# Altium project transmitter-pcb-project.PrjPcb
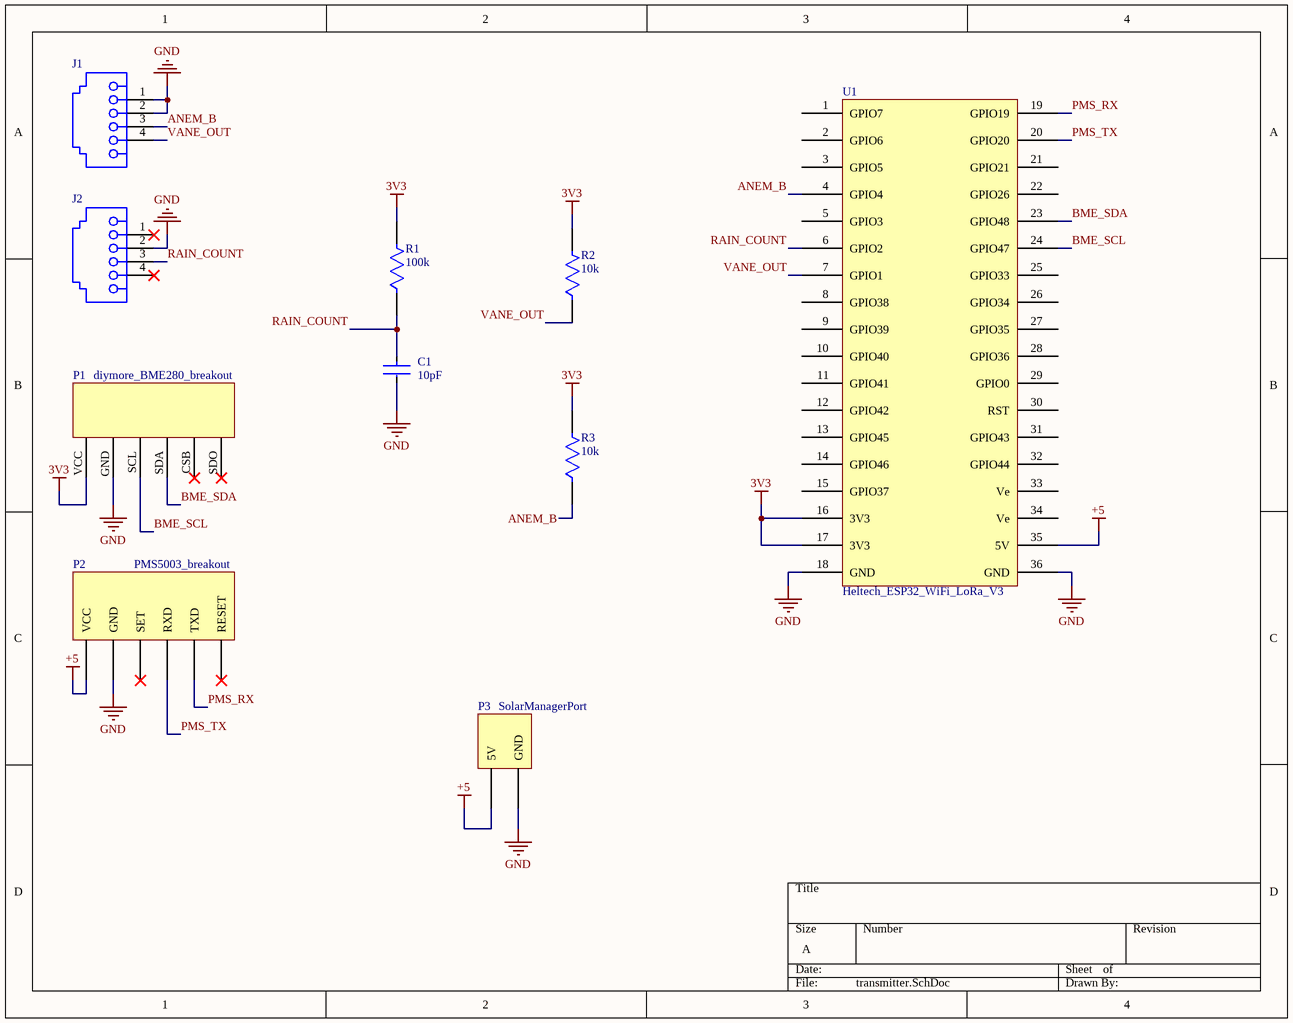
[diagram p0: transmitter.SchDoc]
1 sheet, 10 parts. Net scope: global (net labels, ports and power ports of the same name join across sheets).
Board file: transmitter.PcbDoc

## Sheet transmitter.SchDoc
size A; SheetNumber: 1; SheetTotal: 1

### Parts
C1  Capacitance: 10pF  [FP-VY2103M63Y5US63V7-MFG]  (hidden comment: VY2103M63Y5US63V7)
J1  615004144121  [615004144121]  (value not drawn)
J2  615004144121  [615004144121]  (value not drawn)
P1  diymore_BME280_breakout  [PCBComponent_1]
P2  PMS5003_breakout  [PCBComponent_1]
P3  SolarManagerPort  [PCBComponent_1]
R1  Resistance: 100k  [FP-MRS25-MFG]  (hidden comment: MRS25000C1002FCT00)
R2  Resistance: 10k  [FP-MRS25-MFG]  (hidden comment: MRS25000C1002FCT00)
R3  Resistance: 10k  [FP-MRS25-MFG]  (hidden comment: MRS25000C1002FCT00)
U1  Heltech_ESP32_WiFi_LoRa_V3  [PCBComponent_1]

### Nets
3V3: P1.VCC R1.2 R2.2 R3.2 U1.16(3V3) U1.17(3V3)
+5: P2.VCC P3.5V U1.35(5V)
GND: C1.2 J1.1 J1.2 J2.2 P1.GND P2.GND P3.GND U1.18(GND) U1.36(GND)
ANEM_B: J1.3 R3.1 U1.4(GPIO4)
BME_SCL: P1.SCL U1.24(GPIO47)
BME_SDA: P1.SDA U1.23(GPIO48)
PMS_RX: P2.TXD U1.19(GPIO19)
PMS_TX: P2.RXD U1.20(GPIO20)
RAIN_COUNT: C1.1 J2.3 R1.1 U1.6(GPIO2)
VANE_OUT: J1.4 R2.1 U1.7(GPIO1)

Not connected (* = marked no-connect by the designer): J2 1* 4*; P1 CSB* SDO*; P2 RESET* SET*; U1 1(GPIO7) 2(GPIO6) 3(GPIO5) 5(GPIO3) 8(GPIO38) 9(GPIO39) 10(GPIO40) 11(GPIO41) 12(GPIO42) 13(GPIO45) 14(GPIO46) 15(GPIO37) 21(GPIO21) 22(GPIO26) 25(GPIO33) 26(GPIO34) 27(GPIO35) 28(GPIO36) 29(GPIO0) 30(RST) 31(GPIO43) 32(GPIO44) 33(Ve) 34(Ve)

### Library data of the parts
C1 = CMP-02417-000049-1: CAP CER 10000PF 440VAC Y5U RDL; Tolerance: 20%; Lead/Base Style: Kinked; Voltage Rating (AC): 300V; Lead Length: 30mm; Lead Diameter: 0.6mm; Height - Seated (Max): 0.787inch; Min Operating Temperature: -40°C; Mount: Through Hole; Lead Free: Lead Free; Series: VY2; RoHS Compliant: Yes; Resistor Type: Ceramic; Dielectric: Y5U; Radiation Hardening: No; Construction: RADIAL; Lead Pitch: 7.5mm; Package Quantity: 500; Termination: Radial; Case/Package: Radial; Max Operating Temperature: 125°C; Voltage Rating (DC): 300V; Depth: 5mm; Contact Plating: Tin; Packaging: Bulk
J1 J2 = CMP-1502-01722-2: NexarPartId: 19991158; Contact Resistance: 20mΩ; Insulation Resistance: 500MΩ; Shielding: Unshielded; Operating Supply Voltage: 120V; Number of Ports: 1; Current Rating: 1.5A; Direction: User Selectable; Max Operating Temperature: 85°C; Number of Rows: 1; Mount: Through Hole; Min Operating Temperature: -40°C; Insulation Material: PBT; Contact Plating: Gold; Termination: Solder; Orientation: Vertical; RoHS: Compliant; Housing Material: PBT
P3 = Component_1
R1-R3 = CMP-00030-42632392-1: MRS25000C1002FCT00 Resistor, 10 kOhm, ± 1%, 600 mW, Axial Leaded, Metal Film (Thin Film), Professional; Power Rating: 600mW; Voltage Rating (DC): 350V; Lead Length: 26mm; Temperature Coefficient: 50ppm/°C; Termination: Axial; Number of Terminations: 2; Diameter: 2.5mm; Composition: Metal Film, Thin Film; Number of Pins: 2; Length: 6.5mm; Military Standard: Not; RoHS: Compliant; NexarPartId: 42632392; Width: 2.5mm; Radiation Hardening: No; Voltage Rating: 350V; Max Power Dissipation: 600mW; Min Operating Temperature: -55°C; Lead Free: Lead Free; Max Operating Temperature: 155°C; Tolerance: 1%; Schedule B: 8533210090, 8533210090; Contact Plating: Tin; Mount: Through Hole; REACH SVHC: Unknown; Case/Package: Conformal
U1 = Heltech_ESP32_WiFi_LoRa_V3: ComponentLink1Description: Product Page; ComponentLink1URL: https://heltec.org/project/wifi-lora-32-v3/